# Altium project MC21R01.PrjPCB (part 3 of 3)

## Sheet MC21R01_Power.SchDoc: MC21R01 Top Level
size A3; Author: AMP; DrawnBy: AMP; Organization: Altium Limited; Address1: 3 Minna Close; Address2: Belrose; Address3: NSW 2085; Address4: Australia; DocumentNumber: 0; Revision: 1.0; SheetNumber: 0; SheetTotal: 0
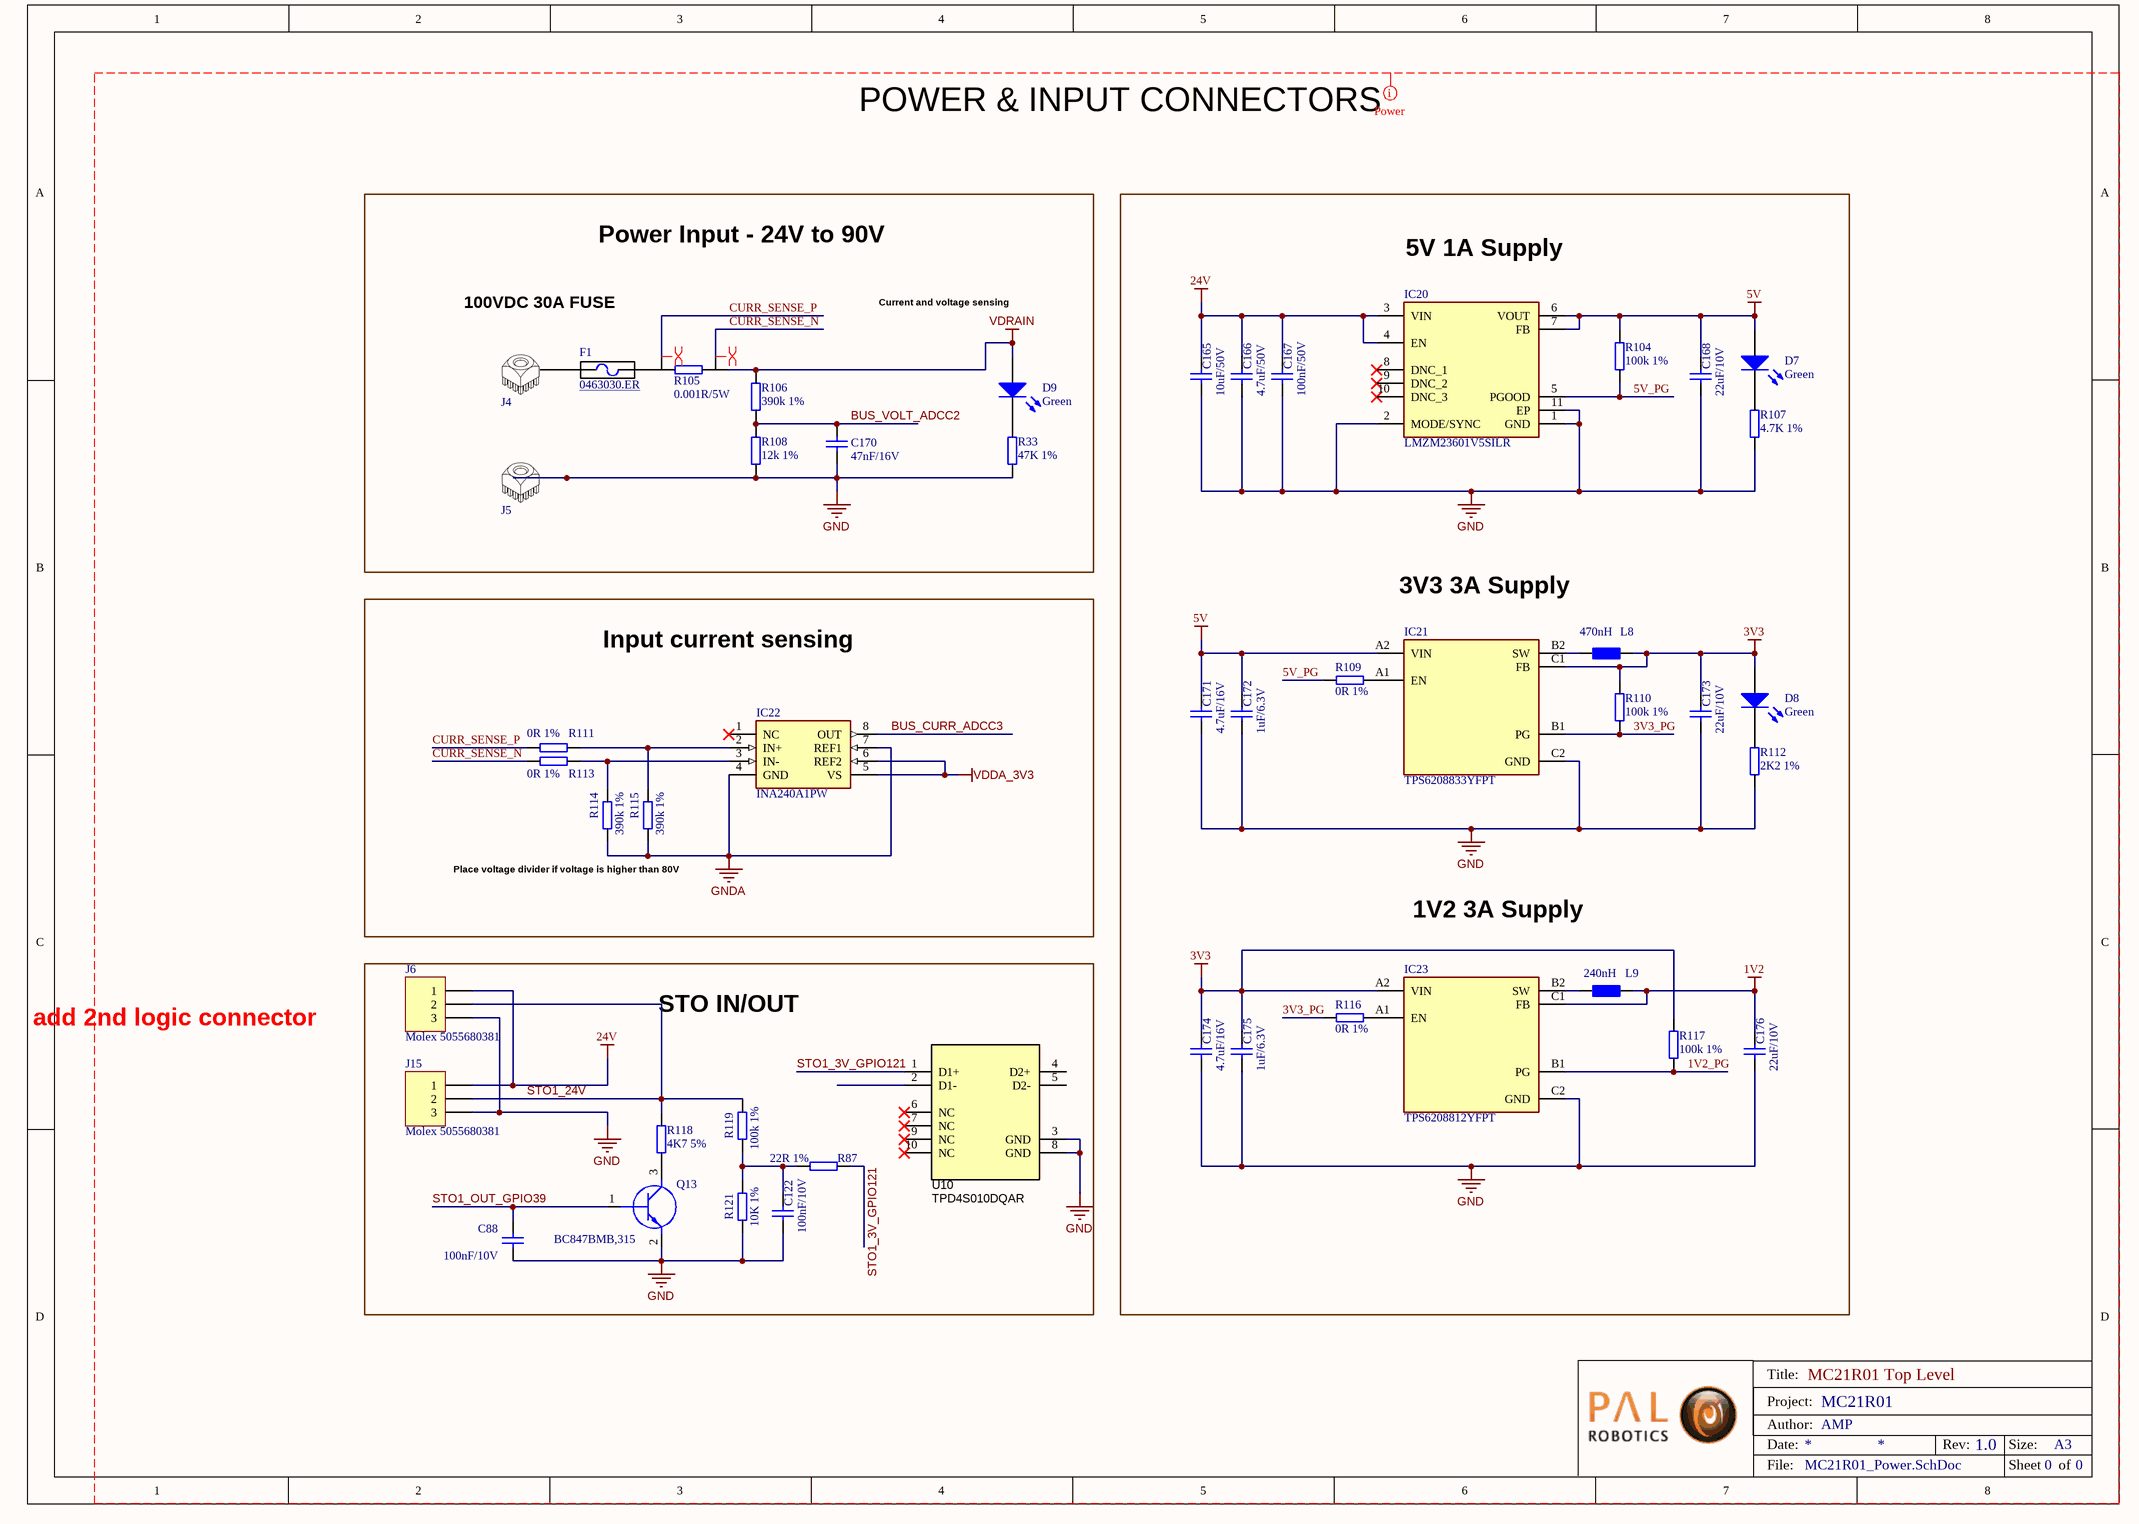
[diagram p11: MC21R01_Power.SchDoc]

### Parts
C88  value 100nF/10V  [0402 SMD Capacitor]  (hidden comment: 100nF/10V 0402 20% X5R)
C122  value 100nF/10V  [0402 SMD Capacitor]  (hidden comment: 100nF/10V 0402 20% X5R)
C165  value 10uF/50V  [1206 SMD Capacitor]  (hidden comment: 10uf/50V 1206 10% X5R)
C166  value 4.7uF/50V  [0805 SMD capacitor]  (hidden comment: 4.7uf/50V 0805 10% X5R)
C167  value 100nF/50V  [0603 SMD capacitor]  (hidden comment: 100nF/50V 0603 10% X7R)
C168  value 22uF/10V  [0603 SMD capacitor]  (hidden comment: 22uF/10V 0603 20% X5R)
C170  value 47nF/16V  [0402 SMD Capacitor]  (hidden comment: 47nF/16V 0402 10% X7R)
C171  value 4.7uF/16V  [0603 SMD capacitor]  (hidden comment: 4.7uF/16V 0603 10% X5R)
C172  value 1uF/6.3V  [0402 SMD Capacitor]  (hidden comment: 1uF/6.3V 0402 10% X5R)
C173  value 22uF/10V  [0603 SMD capacitor]  (hidden comment: 22uF/10V 0603 20% X5R)
C174  value 4.7uF/16V  [0603 SMD capacitor]  (hidden comment: 4.7uF/16V 0603 10% X5R)
C175  value 1uF/6.3V  [0402 SMD Capacitor]  (hidden comment: 1uF/6.3V 0402 10% X5R)
C176  value 22uF/10V  [0603 SMD capacitor]  (hidden comment: 22uF/10V 0603 20% X5R)
D7  Green  [0402 SMD LED GREEN]
D8  Green  [0402 SMD LED GREEN]
D9  Green  [0402 SMD LED GREEN]
F1  0463030.ER  [0463030.ER]
IC20  LMZM23601V5SILR  [LMZM23601V5SILR]
IC21  TPS6208833YFPT  [BGA6C40P2X3_80X120X50]
IC22  INA240A1PW  [SOP65P640X120-8N]
IC23  TPS6208812YFPT  [BGA6C40P2X3_80X120X50]
J4  WE_7461094  [WE_7461094]  (value not drawn)
J5  WE_7461094  [WE_7461094]  (value not drawn)
J6  Molex 5055680381  [Molex 5055680381]
J15  Molex 5055680381  [Molex 5055680381]
L8  470nH  [0603 SMD inductor]
L9  240nH  [0603 SMD inductor]
Q13  BC847BMB,315  [SOT883B]
R33  47K 1%  [0402 SMD rESISTOR]
R87  22R 1%  [0402 SMD rESISTOR]
R104  100k 1%  [0402 SMD rESISTOR]
R105  0.001R/5W  [2512 SMD Resistor V2 NETTIE]
R106  390k 1%  [0603 SMD resistor]
R107  4.7K 1%  [0402 SMD rESISTOR]
R108  12k 1%  [0603 SMD resistor]
R109  0R 1%  [0402 SMD rESISTOR]
R110  100k 1%  [0402 SMD rESISTOR]
R111  0R 1%  [0402 SMD rESISTOR]
R112  2K2 1%  [0402 SMD rESISTOR]
R113  0R 1%  [0402 SMD rESISTOR]
R114  390k 1%  [0603 SMD resistor]
R115  390k 1%  [0603 SMD resistor]
R116  0R 1%  [0402 SMD rESISTOR]
R117  100k 1%  [0402 SMD rESISTOR]
R118  4K7 5%  [0603 SMD resistor]
R119  100k 1%  [0402 SMD rESISTOR]
R121  10K 1%  [0402 SMD rESISTOR]
U10  TPD4S010DQAR  [DQA0010A]

### Blocks framed on the sheet
Power Input - 24V to 90V: C170 D9 F1 J4 J5 R33 R105 R106 R108
Input current sensing: IC22 R111 R113-R115
STO IN/OUT: C88 C122 J6 J15 Q13 R87 R118 R119 R121 U10

### Nets
1V2: C176.1 IC23.C1(FB) L9.1
3V3: C173.1 C174.1 C175.1 D8.A IC21.C1(FB) IC23.A2(VIN) L8.1 R110.2 R117.2
5V: C168.1 C171.1 C172.1 D7.A IC20.6(VOUT) IC20.7(FB) IC21.A2(VIN) R104.2
24V: C165.1 C166.1 C167.1 IC20.3(VIN) IC20.4(EN) J6.1 J15.1
GND: C88.2 C122.2 C165.2 C166.2 C167.2 C168.2 C170.2 C171.2 C172.2 C173.2 C174.2 C175.2 C176.2 IC20.1(GND) IC20.2(MODE/SYNC) IC20.11(EP) IC21.C2(GND) IC23.C2(GND) J5.1 J6.3 J15.3 Q13.2(E) R33.1 R107.1 R108.1 R112.1 R121.1 U10.3(GND) U10.8(GND)
GNDA: IC22.4(GND) IC22.7(REF1) R114.1 R115.1
VDDA_3V3: IC22.5(VS) IC22.6(REF2)
VDRAIN: D9.A R105.1 R106.2
1V2_PG: IC23.B1(PG) R117.1
3V3_PG: IC21.B1(PG) R110.1 R116.2
5V_PG: IC20.5(PGOOD) R104.1 R109.2
BUS_CURR_ADCC3: IC22.8(OUT)
BUS_VOLT_ADCC2: C170.1 R106.1 R108.2
CURR_SENSE_N: R105.3 R113.1
CURR_SENSE_P: R105.4 R111.2
STO1_3V_GPIO121: R87.1 U10.1(D1+)
STO1_24V: J6.2 J15.2 R118.2 R119.2
STO1_OUT_GPIO39: C88.1 Q13.1(B)
NetC122_1: C122.1 R87.2 R119.1 R121.2
NetD7_K: D7.K R107.2
NetD8_K: D8.K R112.2
NetD9_K: D9.K R33.2
NetF1_1: F1.1 J4.1
NetF1_2: F1.2 R105.2
NetIC21_A1: IC21.A1(EN) R109.1
NetIC21_B2: IC21.B2(SW) L8.2
NetIC22_2: IC22.2(IN+) R111.1 R115.2
NetIC22_3: IC22.3(IN-) R113.2 R114.2
NetIC23_A1: IC23.A1(EN) R116.1
NetIC23_B2: IC23.B2(SW) L9.2
NetQ13_3: Q13.3(C) R118.1

Not connected (* = marked no-connect by the designer): IC20 8(DNC_1)* 9(DNC_2)* 10(DNC_3)*; IC22 1(NC)*; U10 2(D1-) 4(D2+) 5(D2-) 6(NC)* 7(NC)* 9(NC)* 10(NC)*

### Layout directives
net class Power: 1V2, 1V2_PG, 3V3, 3V3_PG, 5V, 5V_PG, 24V, BUS_CURR_ADCC3, BUS_VOLT_ADCC2, CURR_SENSE_N, CURR_SENSE_P, GND, GNDA, STO1_3V_GPIO121, STO1_24V, STO1_OUT_GPIO39, VDDA_3V3, VDRAIN
differential pair; differential pair class ADC: CURR_SENSE_N, CURR_SENSE_P

### Notes on the sheet
- POWER & INPUT CONNECTORS
- 5V 1A Supply
- 100VDC 30A FUSE
- Current and voltage sensing
- 3V3 3A Supply
- Place voltage divider if voltage is higher than 80V
- 1V2 3A Supply
- add 2nd logic connector
- Title:
- Date:
- Project:
- Author:
- Rev:
- Size:
- A3
- File:
- Sheet
- of

### Library data of the parts
C88 C122 = 100nF/10V 0402 20% X5R: 100nF/10V 0402 20% Tolerance X5R Multilayer Ceramic Chip Capacitor; Manufacturer 1: KEMET; Manufacturer Part Number 1: C0402C104M8PACTU; Supplier Part Number 1: 2810260; Supplier 1: Farnell
C165 = 10uF/50V 1206 10% X5R: 10 uF 50 V 1206 ±10% Tolerance X5R Multilayer Ceramic Chip Capacitor; Manufacturer 1: TDK; Manufacturer Part Number 1: CGA5L3X5R1H106K160AB; Supplier 1: Farnell; Supplier Part Number 1: 2211092
C166 = 4.7uF/50V 0805 10% X5R: 4.7uF 50 V 0805 ±10% Tolerance X5R Multilayer Ceramic Chip Capacitor; Manufacturer 1: TDK; Manufacturer Part Number 1: C2012X5R1H475K125AB; Supplier 1: Farnell; Supplier Part Number 1: 2346932
C167 = 100nF/50V 0603 10% X7R: 100 nF 50 V 0603  ±10% Tolerance X7R Multilayer Ceramic Chip Capacitor; Manufacturer 1: Samsung; Manufacturer Part Number 1: CL10B104KB8NNNC; Supplier Part Number 1: 1276-1000-1-ND; Supplier 1: Digi-key
C168 C173 C176 = 22uF/10V 0603 20% X5R: 22 uF 10 V 0603 ±20% Tolerance X5R Multilayer Ceramic Chip Capacitor; Manufacturer 1: Murata; Manufacturer Part Number 1: GRM188R60J106KE47D; Supplier 1: Farnell; Supplier Part Number 1: 2426957
C170 = 47nF/16V 0402 10% X7R: 47nF/16V 0402 10% Tolerance X7R Multilayer Ceramic Chip Capacitor; Manufacturer 1: Walsin; Manufacturer Part Number 1: 0402B473J160CT; Supplier 1: Farnell; Supplier Part Number 1: 2524710
C171 C174 = 4.7uF/16V 0603 10% X5R: 4.7uF/16V 0603 10% Tolerance X5R Multilayer Ceramic Chip Capacitor; Manufacturer 1: TAIYO YUDEN; Manufacturer Part Number 1: EMK107B7105KA-T; Supplier 1: Farnell; Supplier 2: Mouser; Supplier 3: Digi-Key; Supplier Part Number 1: 2211173; Supplier Part Number 2: 810-C1608X5R1C475KAC; Supplier Part Number 3: 445-7478-1-ND
C172 C175 = 1uF/6.3V 0402 10% X5R: 1uF/6.3V 0402 10% Tolerance X5R Multilayer Ceramic Chip Capacitor; Manufacturer 1: KEMET; Manufacturer Part Number 1: C0402C105K9PACTU; Supplier Part Number 1: 1288253; Supplier 1: Farnell
D7-D9 = LED_0402_green: Low Profile Chip LED, Green; Manufacturer: ROHM; Manufacturer Part Number: SML-P11MTT86R; Supplier 1: Farnell; Supplier Part Number 1: 2507544
F1 = 0463030.ER: LITTELFUSE - 0463030.ER - 100VDC 30A FUSE SMD; Supplier 1: Farnell; Supplier Part Number 1: 2786390
IC20 = LMZM23601V5SILR: 5V 1A Step-down regulator. 4V to 36V input, 5V fixed output; Manufacturer_Name: Texas Instruments; Datasheet Link: http://www.ti.com/lit/gpn/lmzm23601; Height: 1mm; Manufacturer_Part_Number: LMZM23601V5SILR; Supplier Part Number 1: 595-LMZM23601V5SILR; Supplier 1: Mouser
IC21 = TPS6208833YFPT: 3.3V 3A Step-Down converter; Manufacturer_Name: Texas Instruments; Datasheet Link: http://www.ti.com/lit/gpn/tps62088; Height: 0.5mm; Manufacturer_Part_Number: TPS6208833YFPT; Supplier Part Number 1: 595-TPS6208833YFPT; Supplier 1: Mouser
IC22 = INA240A1PW: 20V/V current sense amplifier; Manufacturer_Name: Texas Instruments; Datasheet Link: http://www.ti.com/general/docs/lit/getliterature.tsp?genericPartNumber=ina240&fileType=pdf; Height: 1.2mm; Manufacturer_Part_Number: INA240A1PW; Supplier Part Number 1: 595-INA240A1PW; Supplier 1: Mouser
IC23 = TPS6208812YFPT: 1.2V 3A Step-Down converter; Manufacturer_Name: Texas Instruments; Datasheet Link: http://www.ti.com/lit/gpn/tps62088; Height: 0.5mm; Manufacturer_Part_Number: TPS6208812YFPT; Supplier Part Number 1: 595-TPS6208812YFPT; Supplier 1: Mouser
J4 J5 = WE_7461094: REDCUBE PRESS-FIT with external thread and full plain pin-plate WPSHFU, 130A, M3 screw, 9pins; Manufacturer: WURTH ELEKTRONIK; Manufacturer Part Number: 7461094; Created by: Yaiza Montes; Published: 29/05/20; Value: WE_7461094; Supplier 1: Farnell; Supplier 2: Mouser; Supplier 3: Digi-Key; Supplier Part Number 1: 1821284; Supplier Part Number 2: 710-7461094; Supplier Part Number 3: 732-3212-ND
J6 J15 = Molex 5055680381: 1.25mm Pitch, Micro-Lock Plus PCB Header, Single Row, Vertical, Surface Mount, Gold Plating, Positive Lock, 3 Circuits, Tape and Reel, Black; Mating Part Number: Molex 5055650301; Crimp: Molex 5054311100; Created by: Yaiza Montes; Published: 20/07/2020; Manufacturer: Molex; Manufacturer Part Number: 5055680381; Supplier 1: Mouser; Supplier Part Number 1: 538-505568-0381
L8 = 470nH/3.2A, 0603 , 2.6 A, 0.054 ohm, ± 20%: Inductor, 470nH, 0603 [1608 Metric], 2.6 A, 0.054 ohm, ± 20%; MPN: DFE18SANR47MG0L; MF: MURATA; Tolerance: ±250%; DC Current Rating: 2.6A; DC Resistance Max:: 0.056R; Impedance: 470nH; Supplier 1: Mouser; Supplier Part Number 1: 81-DFE18SANR47MG0L
L9 = 240nH/3.2A, 0603 , 3 A, 0.036 ohm, ± 20%: Inductor, 240nH, 0603 [1608 Metric], 3.2 A, 0.036 ohm, ± 20%; MPN: DFE18SANR24ME0L; MF: MURATA; Tolerance: ±250%; DC Current Rating: 3.2A; DC Resistance Max:: 0.04R; Impedance: 240nH; Supplier 1: Farnell; Supplier Part Number 1: 2871416
Q13 = BC847BMB,315: Transistor BJT NPN; Manufacturer_Name: Nexperia; Datasheet Link: https://componentsearchengine.com/Datasheets/1/BC847BMB,315.pdf; Manufacturer_Part_Number: BC847BMB,315; Arrow Part Number: BC847BMB,315; Arrow Price/Stock: https://www.arrow.com/en/products/bc847bmb315/nexperia; Mouser Part Number: 771-BC847BMB315; Mouser Price/Stock: https://www.mouser.co.uk/ProductDetail/Nexperia/BC847BMB315?qs=5C9Q4QJFsuN7bUmIcU4LYw%3D%3D
R33 = 47K/50V 1% 0402 100mW: 47K/50V 1% 0402 100mW SMD Resistor; Manufacturer 1: Vishay; Manufacturer Part Number 1: CRCW060347K0FKEA; Supplier 1: Farnell; Supplier Part Number 1: 1469811; Value: 47K
R87 = 22R/50V 1% 0402 63mW: 22R/50V 1% 0402 63mW SMD Resistor; Manufacturer 1: Vishay; Manufacturer Part Number 1: CRCW040222R0FKED; Supplier 1: Farnell; Supplier Part Number 1: 1469697; Value: 22R
R104 R110 R117 R119 = 100k/50V 1% 0402 100mW: 100k/50V 1% 0402 100mW SMD Resistor; Manufacturer 1: Vishay; Manufacturer Part Number 1: CRCW0402100KFKED; Supplier 1: Farnell; Supplier Part Number 1: 1469671; Value: 100k
R105 = 0.001R/5W 1% 2512 Shunt: 0.001R/5W 1% 2512 shunt SMD Resistor; Manufacturer 1: Bourns; Manufacturer Part Number 1: CSS2H-2512R-1L00F; Supplier 1: Farnell; Supplier Part Number 1: 2576347
R106 R114 R115 = 390k/150V 1% 0603 250mW: 390k/150V 1% 0603 250mW SMD Resistor; Manufacturer 1: Panasonic; Manufacturer Part Number 1: ERJPA3F3903V; Supplier 1: Farnell; Supplier Part Number 1: 2335911
R107 = 4.7K/50V 1% 0402 100mW: 4.7K/50V 1% 0402 100mW SMD Resistor; Manufacturer 1: Vishay; Manufacturer Part Number 1: CRCW04024K70FKED; Supplier 1: Farnell; Supplier Part Number 1: 1469712; Value: 4.7K
R108 = 12k/150V 1% 0603 250mW: 12k/150V 1% 0603 250mW SMD Resistor; Manufacturer 1: Panasonic; Manufacturer Part Number 1: ERJPA3F1202V; Supplier 1: Farnell; Supplier Part Number 1: 2335844
R109 R116 = 0R/50V 1% 0402 100mW: 0R/50V 1% 0402 100mW SMD Resistor; Manufacturer 1: Vishay; Manufacturer Part Number 1: CRCW04020000Z0ED; Supplier 1: Farnell; Supplier Part Number 1: 1469661; Value: 0R
R111 R113 = 0R/100V 1% 0402 63mW: 0R/100V 1% 0402 63mW SMD Resistor; Manufacturer 1: Bourns; Manufacturer Part Number 1: CR0402-J/-000GAS; Supplier 1: Farnell; Supplier Part Number 1: 2752981; Value: 0R
R112 = 2K2/50V 1% 0402 100mW: 2K2/50V 1% 0402 100mW SMD Resistor; Manufacturer 1: Yageo; Manufacturer Part Number 1: RC0402FR-072K2L; Value: 2.2k; Supplier 1: Farnell; Supplier Part Number 1: 9239278
R118 = 4K7/75V 5% 0603 100mW: 4K7/75V 5% 0603 100mW SMD Resistor; Manufacturer 1: Yageo; Manufacturer Part Number 1: RC0603JR-074K7L; Supplier 1: Farnell; Supplier Part Number 1: 9233466
R121 = 10K/50V 1% 0402 100mW: 10K/50V 1% 0402 100mW SMD Resistor; Manufacturer 1: Yageo; Manufacturer Part Number 1: RC0402FR-0710KL; Supplier 1: Farnell; Supplier Part Number 1: 9239359; Value: 10K
U10 = TPD4S010DQAR: ESD Solution for High-Speed Differential Interface, 4 Channels, -40 to +85 degC,10-pin SON (DQA), Green (RoHS & no Sb/Br); Manufacturer: Texas Instruments; IO Leakage Current(nA): 10; IO Capacitance(Typ)(pF): 0.8; 1394 / Firewire: TRUE; Breakdown Voltage(Min)(V): 9; Differential Capacitance(pF): 0.05; IEC 61000-4-2 Contact(+/- kV): 8; ComponentLink1URL: http://www.ti.com/; PackageDescription: 10-Pin Plastic Small Outline No-Lead, 1 x 2.5 x 0.55 mm Body, 0.5 mm Pitch; ComponentLink2URL: http://www.ti.com/general/docs/lit/getliterature.tsp?genericPartNumber=TPD4S010&fileType=pdf; Serial ATA / eSATA: TRUE; ComponentLink3Description: URL Link1; Eco-Plan: Green (RoHS & no Sb/Br); ComponentLink2Description: Datasheet; ComponentLink3URL: SamplesURL:http://www.ti.com/product/tpd4s010#samples; PackageReference: DQA0010A; DatasheetVersion: SLVS817E; SubFamily: ESD Solution; PackageVersion: revB, Sep-2009; Mounting Technology: Surface Mount; ComponentLink1Description: Manufacturer URL; IEC 61000-4-2 Air-Gap(+/- kV): 9; PartNumber: TPD4S010DQAR

## Nets that join several sheets
1V2: MC21R01_uC_Power (C138.1 L7.2), MC21R01_Power (C176.1 IC23.C1 L9.1)
3V3: MC21R01_uC_Power (C134.1 C136.1 L5.2 L6.2), MC21R01_BoardtoBoard_connectors (J1.14), MC21R01_Power (9 pins)
5V: MC21R01_BoardtoBoard_connectors (J1.16), MC21R01_Power (8 pins)
24V: MC21R01_Inverter_1 (C6.1 C7.1 U3.3), MC21R01_Inverter_2 (C29.1 C30.1 U4.3), MC21R01_BoardtoBoard_connectors (J1.17 J1.18), MC21R01_Power (7 pins)
GND: MC21R01_uC_Support (15 pins), MC21R01_uC_Power (121 pins), MC21R01_Inverter_1 (21 pins), MC21R01_Inverter_2 (18 pins), MC21R01_Onboard_temp_sensors (16 pins), MC21R01_uC_ADC (5 pins), MC21R01_EtherCAT (38 pins), MC21R01_BoardtoBoard_connectors (7 pins), MC21R01_Power (29 pins)
GNDA: MC21R01_uC_Power (8 pins), MC21R01_Inverter_1 (9 pins), MC21R01_Inverter_2 (9 pins), MC21R01_uC_ADC (48 pins), MC21R01_Power (IC22.4 IC22.7 R114.1 R115.1)
VDD_3V3: MC21R01_uC_Support (14 pins), MC21R01_uC_Power (66 pins), MC21R01_Inverter_1 (D1.A R20.2 R27.2), MC21R01_Inverter_2 (D2.A R40.2), MC21R01_Onboard_temp_sensors (16 pins), MC21R01_EtherCAT (35 pins)
VDDA_3V3: MC21R01_uC_Power (6 pins), MC21R01_Inverter_1 (R29.2), MC21R01_Inverter_2 (R42.2), MC21R01_uC_ADC (8 pins), MC21R01_Power (IC22.5 IC22.6)
VDRAIN: MC21R01_Inverter_1 (38 pins), MC21R01_Inverter_2 (23 pins), MC21R01_BoardtoBoard_connectors (J2.1), MC21R01_Power (D9.A R105.1 R106.2)
1V2_PG: MC21R01_uC_Support (R11.2), MC21R01_Power (IC23.B1 R117.1)
BMSP0_GPIO72: MC21R01_uC_Support (R3.1 R7.2), MC21R01_uC_GPIO (U1.B16)
BMSP1_GPIO73: MC21R01_uC_Support (R4.1 R8.2), MC21R01_uC_GPIO (U1.A16)
BUS_CURR_ADCC3: MC21R01_uC_ADC (R90.2 U9.5), MC21R01_Power (IC22.8)
BUS_VOLT_ADCC2: MC21R01_uC_ADC (R89.2 U8.5), MC21R01_Power (C170.1 R106.1 R108.2)
CM_I2CA_SCL_GPIO105: MC21R01_uC_GPIO (U1.J3), MC21R01_BoardtoBoard_connectors (J3.12)
CM_I2CA_SDA_GPIO104: MC21R01_uC_GPIO (U1.J2), MC21R01_BoardtoBoard_connectors (J3.10)
DRV1_2_CLK_GPIO18: MC21R01_uC_GPIO (U1.E3), MC21R01_Inverter_1 (U3.29), MC21R01_Inverter_2 (U4.29)
DRV1_2_SIMO_GPIO16: MC21R01_uC_GPIO (U1.E1), MC21R01_Inverter_1 (U3.28), MC21R01_Inverter_2 (U4.28)
DRV1_2_SOMI_GPIO17: MC21R01_uC_GPIO (R66.2), MC21R01_Inverter_1 (R20.1 U3.27), MC21R01_Inverter_2 (U4.27)
DRV1_3V3_REF: MC21R01_Inverter_1 (C26.1 U3.24), MC21R01_uC_ADC (IC17.C1 IC17.C3)
DRV1_ENABLE_GPIO89: MC21R01_uC_GPIO (U1.D6), MC21R01_Inverter_1 (U3.31)
DRV1_INHA_GPIO00: MC21R01_uC_GPIO (U1.C8), MC21R01_Inverter_1 (U3.32)
DRV1_INHB_GPIO02: MC21R01_uC_GPIO (U1.A7), MC21R01_Inverter_1 (U3.34)
DRV1_INHC_GPIO04: MC21R01_uC_GPIO (U1.C7), MC21R01_Inverter_1 (U3.36)
DRV1_INLA_GPIO01: MC21R01_uC_GPIO (U1.D8), MC21R01_Inverter_1 (U3.33)
DRV1_INLB_GPIO03: MC21R01_uC_GPIO (U1.B7), MC21R01_Inverter_1 (U3.35)
DRV1_INLC_GPIO05: MC21R01_uC_GPIO (U1.D7), MC21R01_Inverter_1 (U3.37)
DRV1_ISENA_ADCA0: MC21R01_Inverter_1 (U3.23), MC21R01_uC_ADC (R73.2)
DRV1_ISENB_ADCB0: MC21R01_Inverter_1 (U3.22), MC21R01_uC_ADC (R82.2)
DRV1_ISENC_ADCD0: MC21R01_Inverter_1 (U3.21), MC21R01_uC_ADC (R94.2)
DRV1_MOT_TEMP_ADCC4: MC21R01_Inverter_1 (C*1.1 R29.1), MC21R01_uC_ADC (R91.2)
DRV1_nCS_GPIO19: MC21R01_uC_GPIO (U1.E4), MC21R01_Inverter_1 (U3.30)
DRV1_nFAULT_GPIO90: MC21R01_uC_GPIO (U1.A5), MC21R01_Inverter_1 (R27.1 R28.1 U3.26)
DRV1_VSENA_ADCA2: MC21R01_Inverter_1 (C21.1 R17.1 R21.2), MC21R01_uC_ADC (R75.2 U8.1)
DRV1_VSENB_ADCB2: MC21R01_Inverter_1 (C19.1 R18.1 R22.2), MC21R01_uC_ADC (R84.2 U8.2)
DRV1_VSENC_ADCD2: MC21R01_Inverter_1 (C20.1 R19.1 R23.2), MC21R01_uC_ADC (R96.2 U8.4)
DRV2_3V3_REF: MC21R01_Inverter_2 (C49.1 U4.24), MC21R01_uC_ADC (IC18.C1 IC18.C3)
DRV2_ENABLE_GPIO37: MC21R01_uC_GPIO (U1.U16), MC21R01_Inverter_2 (U4.31)
DRV2_INHA_GPIO06: MC21R01_uC_GPIO (U1.A6), MC21R01_Inverter_2 (U4.32)
DRV2_INHB_GPIO08: MC21R01_uC_GPIO (U1.G2), MC21R01_Inverter_2 (U4.34)
DRV2_INHC_GPIO10: MC21R01_uC_GPIO (U1.B2), MC21R01_Inverter_2 (U4.36)
DRV2_INLA_GPIO07: MC21R01_uC_GPIO (U1.B6), MC21R01_Inverter_2 (U4.33)
DRV2_INLB_GPIO09: MC21R01_uC_GPIO (U1.G3), MC21R01_Inverter_2 (U4.35)
DRV2_INLC_GPIO11: MC21R01_uC_GPIO (U1.C1), MC21R01_Inverter_2 (U4.37)
DRV2_ISENA_ADCA1: MC21R01_Inverter_2 (U4.23), MC21R01_uC_ADC (R74.2)
DRV2_ISENB_ADCB1: MC21R01_Inverter_2 (U4.22), MC21R01_uC_ADC (R83.2)
DRV2_ISENC_ADCD1: MC21R01_Inverter_2 (U4.21), MC21R01_uC_ADC (R95.2)
DRV2_MOT_TEMP_ADCC5: MC21R01_Inverter_2 (C*2.1 R42.1), MC21R01_uC_ADC (R92.2)
DRV2_nCS_GPIO35: MC21R01_uC_GPIO (U1.T14), MC21R01_Inverter_2 (U4.30)
DRV2_nFAULT_GPIO36: MC21R01_uC_GPIO (U1.V16), MC21R01_Inverter_2 (R40.1 R41.1 U4.26)
DRV2_VSENA_ADCA3: MC21R01_Inverter_2 (C44.1 R30.1 R34.2), MC21R01_uC_ADC (R76.2 U9.4)
DRV2_VSENB_ADCB3: MC21R01_Inverter_2 (C42.1 R31.1 R35.2), MC21R01_uC_ADC (R85.2 U9.2)
DRV2_VSENC_ADCD3: MC21R01_Inverter_2 (C43.1 R32.1 R36.2), MC21R01_uC_ADC (R97.2 U9.1)
ECAT0_INT_GPIO154: MC21R01_uC_GPIO (U1.B12), MC21R01_EtherCAT (R50.2 U5.21)
ECAT0_LINK_GPIO143: MC21R01_uC_GPIO (U1.F18), MC21R01_EtherCAT (R59.2)
ECAT0_PHYLINK_GPIO148: MC21R01_uC_GPIO (U1.D14), MC21R01_EtherCAT (U5.31)
ECAT0_RXCLK_GPIO163: MC21R01_uC_GPIO (U1.A8), MC21R01_EtherCAT (U5.19)
ECAT0_RXD0_GPIO165: MC21R01_uC_GPIO (U1.C5), MC21R01_EtherCAT (U5.16)
ECAT0_RXD1_GPIO166: MC21R01_uC_GPIO (U1.D5), MC21R01_EtherCAT (U5.15)
ECAT0_RXD2_GPIO167: MC21R01_uC_GPIO (U1.C4), MC21R01_EtherCAT (U5.14)
ECAT0_RXD3_GPIO168: MC21R01_uC_GPIO (U1.D4), MC21R01_EtherCAT (R46.1 U5.13)
ECAT0_RXDV_GPIO162: MC21R01_uC_GPIO (U1.D9), MC21R01_EtherCAT (U5.18)
ECAT0_RXERR_GPIO164: MC21R01_uC_GPIO (U1.B8), MC21R01_EtherCAT (R44.2 U5.20)
ECAT0_TXCLK_GPIO157: MC21R01_uC_GPIO (U1.B10), MC21R01_EtherCAT (U5.22)
ECAT0_TXD0_GPIO158: MC21R01_uC_GPIO (U1.C10), MC21R01_EtherCAT (U5.24)
ECAT0_TXD1_GPIO159: MC21R01_uC_GPIO (U1.D10), MC21R01_EtherCAT (U5.25)
ECAT0_TXD2_GPIO160: MC21R01_uC_GPIO (U1.B9), MC21R01_EtherCAT (U5.26)
ECAT0_TXD3_GPIO161: MC21R01_uC_GPIO (U1.C9), MC21R01_EtherCAT (U5.27)
ECAT0_TXEN_GPIO156: MC21R01_uC_GPIO (U1.D12), MC21R01_EtherCAT (U5.23)
ECAT1_INT_GPIO128: MC21R01_uC_GPIO (U1.W9), MC21R01_EtherCAT (R58.2 U6.21)
ECAT1_LINK_GPIO144: MC21R01_uC_GPIO (U1.F17), MC21R01_EtherCAT (R60.2)
ECAT1_PHYLINK_GPIO68: MC21R01_uC_GPIO (U1.C18), MC21R01_EtherCAT (U6.31)
ECAT1_RXCLK_GPIO137: MC21R01_uC_GPIO (U1.T18), MC21R01_EtherCAT (U6.19)
ECAT1_RXD0_GPIO139: MC21R01_uC_GPIO (U1.N19), MC21R01_EtherCAT (U6.16)
ECAT1_RXD1_GPIO140: MC21R01_uC_GPIO (U1.M19), MC21R01_EtherCAT (U6.15)
ECAT1_RXD2_GPIO141: MC21R01_uC_GPIO (U1.M18), MC21R01_EtherCAT (U6.14)
ECAT1_RXD3_GPIO142: MC21R01_uC_GPIO (U1.L19), MC21R01_EtherCAT (R54.1 U6.13)
ECAT1_RXDV_GPIO136: MC21R01_uC_GPIO (U1.T17), MC21R01_EtherCAT (U6.18)
ECAT1_RXER_GPIO138: MC21R01_uC_GPIO (U1.T19), MC21R01_EtherCAT (R52.2 U6.20)
ECAT1_TXCLK_GPIO130: MC21R01_uC_GPIO (U1.U10), MC21R01_EtherCAT (U6.22)
ECAT1_TXD0_GPIO131: MC21R01_uC_GPIO (U1.V10), MC21R01_EtherCAT (U6.24)
ECAT1_TXD1_GPIO132: MC21R01_uC_GPIO (U1.W18), MC21R01_EtherCAT (U6.25)
ECAT1_TXD2_GPIO134: MC21R01_uC_GPIO (U1.V18), MC21R01_EtherCAT (U6.26)
ECAT1_TXD3_GPIO135: MC21R01_uC_GPIO (U1.U18), MC21R01_EtherCAT (U6.27)
ECAT1_TXEN_GPIO129: MC21R01_uC_GPIO (U1.T10), MC21R01_EtherCAT (U6.23)
ECAT_EEPROM_SCL_GPIO151: MC21R01_uC_GPIO (U1.C13), MC21R01_EtherCAT (EEPROM1.6 R62.1)
ECAT_EEPROM_SDA_GPIO150: MC21R01_uC_GPIO (U1.B13), MC21R01_EtherCAT (EEPROM1.5 R61.1)
ECAT_ERROR_GPIO145: MC21R01_uC_GPIO (U1.E17), MC21R01_EtherCAT (D5.K)
ECAT_MDC_GPIO152: MC21R01_uC_GPIO (U1.D13), MC21R01_EtherCAT (U5.12 U6.12)
ECAT_MDIO_GPIO153: MC21R01_uC_GPIO (U1.A12), MC21R01_EtherCAT (R48.1 R56.1 U5.11 U6.11)
ECAT_nRST_GPIO155: MC21R01_uC_GPIO (U1.C12), MC21R01_EtherCAT (U5.32 U6.32)
ECAT_RUN_GPIO146: MC21R01_uC_GPIO (U1.D18), MC21R01_EtherCAT (D6.K)
ENC1_BISS_BRIDGE_GPIO13: MC21R01_uC_GPIO (U1.D1), MC21R01_BoardtoBoard_connectors (J2.15)
ENC1_BISS_CLK_GPIO12: MC21R01_uC_GPIO (U1.C2), MC21R01_BoardtoBoard_connectors (J2.13)
ENC1_CLK_GPIO65: MC21R01_uC_GPIO (U1.K16), MC21R01_BoardtoBoard_connectors (J2.9)
ENC1_CS_GPIO66: MC21R01_uC_GPIO (U1.K17), MC21R01_BoardtoBoard_connectors (J2.11)
ENC1_SIMO_GPIO63: MC21R01_uC_GPIO (U1.J16), MC21R01_BoardtoBoard_connectors (J2.5)
ENC1_SOMI_GPIO64: MC21R01_uC_GPIO (R69.2), MC21R01_BoardtoBoard_connectors (J2.7)
ENC2_BISS_BRIDGE_GPIO15: MC21R01_uC_GPIO (U1.D3), MC21R01_BoardtoBoard_connectors (J2.12)
ENC2_BISS_CLK_GPIO14: MC21R01_uC_GPIO (U1.D2), MC21R01_BoardtoBoard_connectors (J2.10)
ENC2_CLK_GPIO93: MC21R01_uC_GPIO (U1.B4), MC21R01_BoardtoBoard_connectors (J2.6)
ENC2_CS_GPIO94: MC21R01_uC_GPIO (U1.A3), MC21R01_BoardtoBoard_connectors (J2.8)
ENC2_SIMO_GPIO91: MC21R01_uC_GPIO (U1.B5), MC21R01_BoardtoBoard_connectors (J2.2)
ENC2_SOMI_GPIO92: MC21R01_uC_GPIO (R65.1), MC21R01_BoardtoBoard_connectors (J2.4)
ENC3_CLK_GPIO56: MC21R01_uC_GPIO (U1.N16), MC21R01_BoardtoBoard_connectors (J1.5)
ENC3_CS_GPIO57: MC21R01_uC_GPIO (U1.N18), MC21R01_BoardtoBoard_connectors (J1.7)
ENC3_SIMO_GPIO54: MC21R01_uC_GPIO (U1.P18), MC21R01_BoardtoBoard_connectors (J1.1)
ENC3_SOMI_GPIO55: MC21R01_uC_GPIO (R67.2), MC21R01_BoardtoBoard_connectors (J1.3)
ENC4_CLK_GPIO60: MC21R01_uC_GPIO (U1.M17), MC21R01_BoardtoBoard_connectors (J1.13)
ENC4_CS_GPIO61: MC21R01_uC_GPIO (U1.L16), MC21R01_BoardtoBoard_connectors (J1.12)
ENC4_SIMO_GPIO58: MC21R01_uC_GPIO (U1.N17), MC21R01_BoardtoBoard_connectors (J1.9)
ENC4_SOMI_GPIO59: MC21R01_uC_GPIO (R68.2), MC21R01_BoardtoBoard_connectors (J1.11)
EQEP1A_GPIO20: MC21R01_uC_GPIO (U1.F2), MC21R01_BoardtoBoard_connectors (J3.4)
EQEP1B_GPIO21: MC21R01_uC_GPIO (U1.F3), MC21R01_BoardtoBoard_connectors (J3.2)
EQEP1I_GPIO23: MC21R01_uC_GPIO (U1.K4), MC21R01_BoardtoBoard_connectors (J3.6)
EQEP2A_GPIO24: MC21R01_uC_GPIO (U1.K3), MC21R01_BoardtoBoard_connectors (J1.6)
EQEP2B_GPIO25: MC21R01_uC_GPIO (U1.K2), MC21R01_BoardtoBoard_connectors (J1.8)
EQEP2I_GPIO26: MC21R01_uC_GPIO (U1.K1), MC21R01_BoardtoBoard_connectors (J1.10)
EXT_CLK_GPIO52: MC21R01_uC_GPIO (U1.P16), MC21R01_BoardtoBoard_connectors (J3.5)
EXT_CS_GPIO103: MC21R01_uC_GPIO (U1.J1), MC21R01_BoardtoBoard_connectors (J3.7)
EXT_SIMO_GPIO50: MC21R01_uC_GPIO (U1.R18), MC21R01_BoardtoBoard_connectors (J3.1)
EXT_SOMI_GPIO51: MC21R01_uC_GPIO (U1.R19), MC21R01_BoardtoBoard_connectors (J3.3)
FS1_I2CA_SCL_GPIO32: MC21R01_uC_GPIO (U1.U13), MC21R01_BoardtoBoard_connectors (J2.19)
FS1_I2CA_SDA_GPIO31: MC21R01_uC_GPIO (U1.U11), MC21R01_BoardtoBoard_connectors (J2.17)
FS2_I2CB_SCL_GPIO41: MC21R01_uC_GPIO (U1.U17), MC21R01_BoardtoBoard_connectors (J2.16)
FS2_I2CB_SDA_GPIO40: MC21R01_uC_GPIO (U1.V17), MC21R01_BoardtoBoard_connectors (J2.14)
MCAN_RX_GPIO70: MC21R01_uC_GPIO (U1.A17), MC21R01_BoardtoBoard_connectors (J3.13)
MCAN_TX_GPIO71: MC21R01_uC_GPIO (U1.B17), MC21R01_BoardtoBoard_connectors (J3.15)
P0_25MHZ_CLK: MC21R01_uC_Support (R12.1), MC21R01_EtherCAT (U5.9)
P1_25MHZ_CLK: MC21R01_uC_Support (R13.1), MC21R01_EtherCAT (U6.9)
RGB_B_GPIO116: MC21R01_uC_Support (R77.2), MC21R01_uC_GPIO (U1.W10)
RGB_G_GPIO29: MC21R01_uC_Support (R78.2), MC21R01_uC_GPIO (U1.W11)
RGB_R_GPIO28: MC21R01_uC_Support (R86.2), MC21R01_uC_GPIO (U1.V11)
SB24_ADC_IN1415_N: MC21R01_uC_ADC (R80.2), MC21R01_BoardtoBoard_connectors (J1.4)
SB24_ADC_IN1415_P: MC21R01_uC_ADC (R79.2), MC21R01_BoardtoBoard_connectors (J1.2)
STO1_3V_GPIO121: MC21R01_uC_GPIO (U1.W16), MC21R01_Power (R87.1 U10.1)
STO1_OUT_GPIO39: MC21R01_uC_GPIO (U1.W17), MC21R01_Power (C88.1 Q13.1)
TEMP_CHAIN_RX_GPIO85: MC21R01_uC_GPIO (U1.B11), MC21R01_Onboard_temp_sensors (IC8.B1)
TEMP_CHAIN_TX_GPIO84: MC21R01_uC_GPIO (U1.A11), MC21R01_Onboard_temp_sensors (IC1.B2)
USB0_DM_GPIO42: MC21R01_uC_GPIO (U1.D19), MC21R01_BoardtoBoard_connectors (J3.9)
USB0_DP_GPIO43: MC21R01_uC_GPIO (U1.C19), MC21R01_BoardtoBoard_connectors (J3.11)